# Altium schematic sheet Power Supply.SchDoc
size A4; SheetNumber: 6; SheetTotal: 7
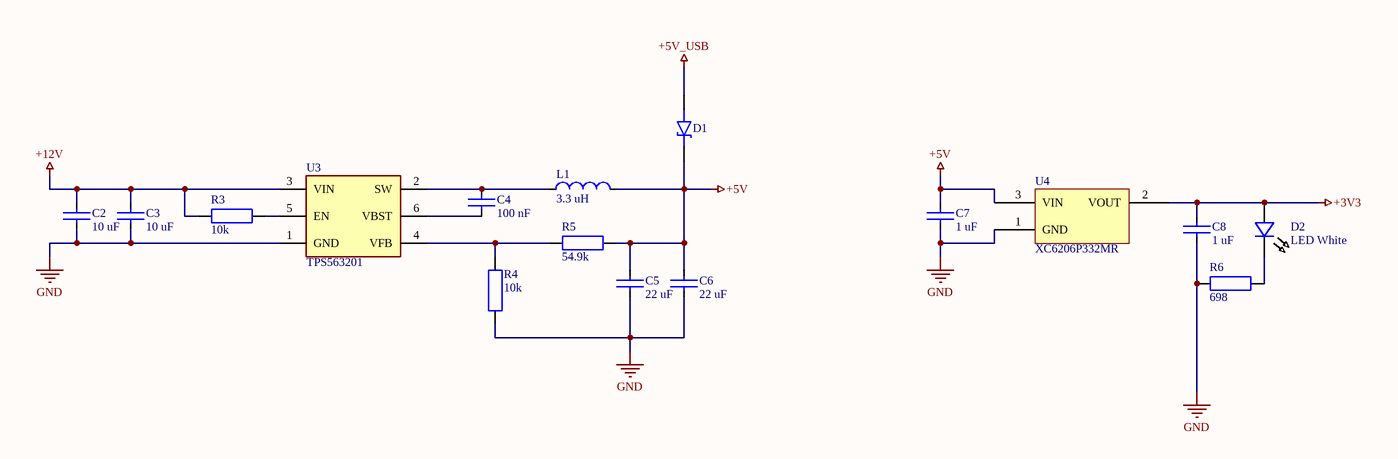
[diagram p0: Power Supply.SchDoc]

## Parts
C2  10 uF  [0603 SMD CAP]
C3  10 uF  [0603 SMD CAP]
C4  100 nF  [0603 SMD CAP]
C5  22 uF  [0805 SMD Cap]
C6  22 uF  [0805 SMD Cap]
C7  1 uF  [0603 SMD CAP]
C8  1 uF  [0603 SMD CAP]
D1  Diode Shottky SOD-323  [SOD-323]  (value not drawn)
D2  LED White  [0603 SMD LED]
L1  3.3 uH  [1210 Inductor SMD]
R3  10k  [0603 SMD Res]
R4  10k  [0603 SMD Res]
R5  54.9k  [0603 SMD Res]
R6  698  [0603 SMD Res]
U3  TPS563201  [SOT23-6L]
U4  XC6206P332MR  [SOT23-3]

## Nets
+3V3: C8.2 D2.1 U4.2(VOUT)
+5V: C5.2 C6.2 C7.2 D1.2 L1.2 R5.1 U4.3(VIN)
+5V_USB: D1.1
+12V: C2.2 C3.2 R3.2 U3.3(VIN)
GND: C2.1 C3.1 C5.1 C6.1 C7.1 C8.1 R4.1 R6.2 U3.1(GND) U4.1(GND)
NetC4_1: C4.1 U3.6(VBST)
NetC4_2: C4.2 L1.1 U3.2(SW)
NetD2_2: D2.2 R6.1
NetR3_1: R3.1 U3.5(EN)
NetR4_2: R4.2 R5.2 U3.4(VFB)

## Library data of the parts
C2 C3 = Cap 10uf 0603: 25V 10uF X5R ±20% 0603 Multilayer Ceramic Capacitors; Part Number: CL10A106MA8NRNC
C4 = Cap 100nF 0603: 25V 100nF X7R ±10% 0603 Multilayer Ceramic Capacitors MLCC; Part Number: CL10B104KA8NNNC; ComponentLink1Description: LCSC; ComponentLink1URL: https://lcsc.com/product-detail/Multilayer-Ceramic-Capacitors-MLCC-SMD-SMT_Samsung-Electro-Mechanics-CL10B104KA8NNNC_C1590.html
C5 C6 = Cap 22uF 0805: 25V 22uF X5R ±20% 0805 Multilayer Ceramic Capacitors; Part Number: CL21A226MAYNNNE
C7 C8 = Cap 1u 0603: 25V 1uF X5R ±10% 0603 Multilayer Ceramic Capacitors MLCC; Part Number: CC0603KRX5R8BB105
D1 = Diode Shottky SOD-323: 20V 450mV@1A 1A SOD-323 Schottky Barrier Diodes; Part Number: B5817WS; ComponentLink1Description: LCSC; ComponentLink1URL: https://lcsc.com/product-detail/Schottky-Barrier-Diodes-SBD_Shandong-Jingdao-Microelectronics-B5817WS_C123899.html
D2 = LED White 0603: 5mA Yellow -40℃~+85℃ White light 120° 100mW 0603 Light Emitting Diodes (LED) ROHS; Part Number: SZYY0603W; ComponentLink1Description: Datasheet; ComponentLink1URL: https://datasheet.lcsc.com/lcsc/1912111437_Yongyu-Photoelectric-SZYY0603W_C434422.pdf
L1 = Ind 3.3mH 1210: 1.55A 3.3uH ±30% 1.9A 100mΩ 1210 Inductors (SMD) ROHS; Part Number: LQH32PN3R3NNCL; ComponentLink1Description: Datasheet; ComponentLink1URL: https://datasheet.lcsc.com/lcsc/2108040830_Murata-Electronics-LQH32PN3R3NNCL_C2044639.pdf
R3 R4 = Resistor 10k 0603 1%: Part Number: RC0603FR-0710KL
R5 = Resistor 54.9k 0603 1%: 100mW Thick Film Resistors 75V ±100ppm/℃ ±1% -55℃~+155℃ 54.9kΩ 0603; Part Number: RC0603FR-0754K9L; ComponentLink1Description: LCSC; ComponentLink1URL: https://lcsc.com/product-detail/Chip-Resistor-Surface-Mount_YAGEO-RC0603FR-0754K9L_C185321.html
R6 = Resistor 698 0603 1%: 100mW Thick Film Resistors 75V ±100ppm/℃ ±1% -55℃~+155℃ 698Ω 0603 Chip Resistor; Part Number: AC0603FR-07698RL; ComponentLink1Description: LCSC; ComponentLink1URL: https://lcsc.com/product-detail/Chip-Resistor-Surface-Mount_YAGEO-AC0603FR-07698RL_C144640.html
U3 = DC-DC Buck Converter TPS563201: Step-down type -40℃~+125℃@(TJ) 1 Step-down Adjustable 0.768V~7V 3A 4.5V~17V 580kHz SOT-23-THIN-6; Part Number: TPS563201DDCR; ComponentLink1Description: Datasheet; ComponentLink1URL: https://www.ti.com/lit/ds/symlink/tps563201.pdf?ts=1668072977388
U4 = LDO 3V3 SOT-23-3: 40dB@(1kHz) 100mA 240mV@(50mA) Fixed 3.3V~3.3V Positive 1 8V SOT-23 Linear Voltage Regulators; Part Number: XC6206P332MR; ComponentLink1Description: Datasheet; ComponentLink1URL: https://static.chipdip.ru/lib/848/DOC018848972.pdf